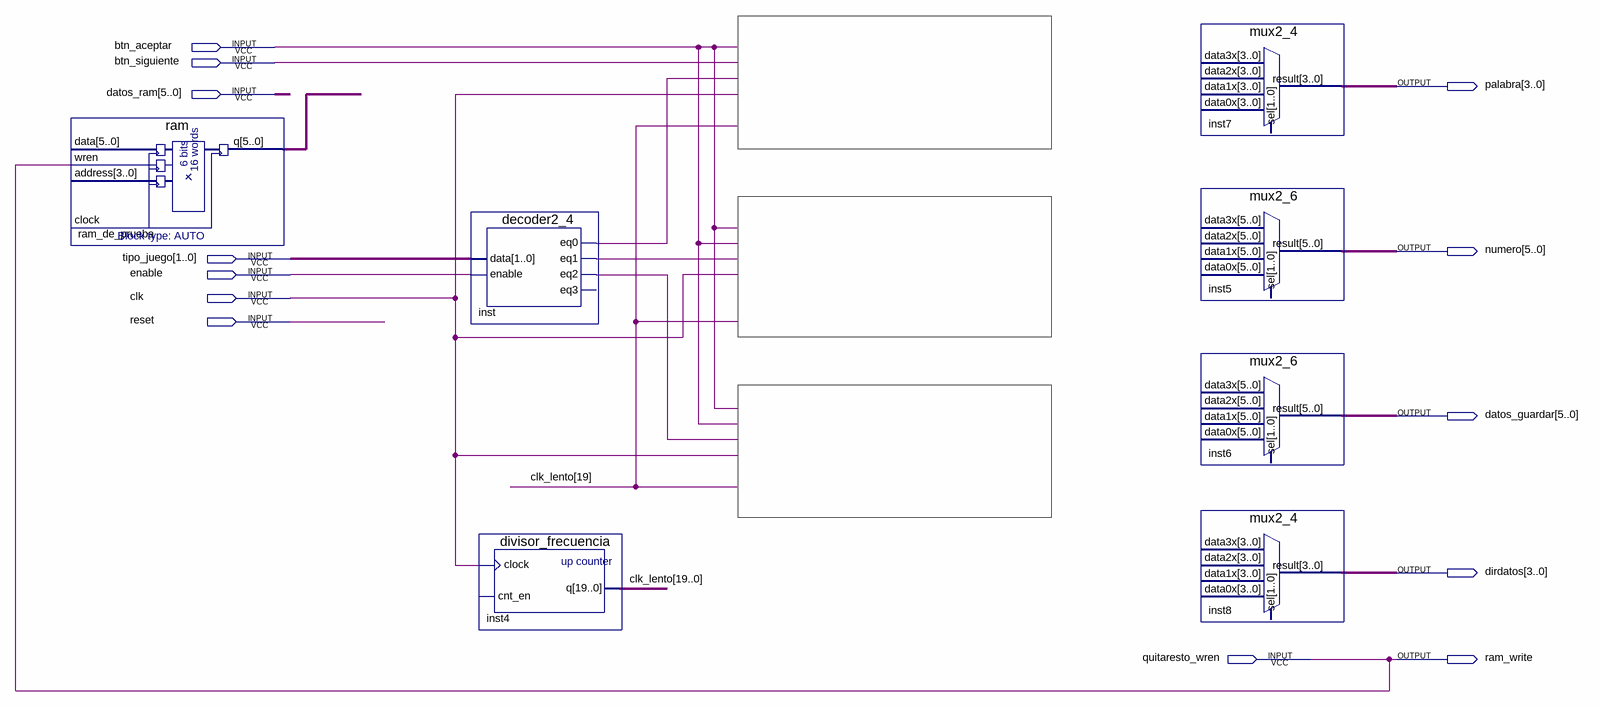
[diagram p0: schematic sheet]
// Quartus schematic bloque_juego.bdf as structural Verilog: 7 symbols, 13 pins
module bloque_juego (
  input  btn_aceptar,
  input  btn_siguiente,
  input  [5:0] datos_ram,
  input  [1:0] tipo_juego,
  input  enable,
  input  clk,
  input  reset,
  input  quitaresto_wren,
  output [3:0] palabra,
  output [5:0] numero,
  output [5:0] datos_guardar,
  output [3:0] dirdatos,
  output ram_write
);

  wire inst_eq0, inst_eq1, inst_eq2;
  wire [5:0] ram_de_prueba_q;
  wire [19:0] clk_lento;

  ram ram_de_prueba (.wren(quitaresto_wren), .q(ram_de_prueba_q));  // open: data, address, clock
  decoder2_4 inst (.data(tipo_juego), .enable(enable), .eq0(inst_eq0), .eq1(inst_eq1), .eq2(inst_eq2));  // open: eq3
  divisor_frecuencia inst4 (.clock(clk), .q(clk_lento));  // open: cnt_en
  mux2_4 inst7 (.result(palabra));  // open: data3x, data2x, data1x, data0x, sel
  mux2_6 inst5 (.result(numero));  // open: data3x, data2x, data1x, data0x, sel
  mux2_6 inst6 (.result(datos_guardar));  // open: data3x, data2x, data1x, data0x, sel
  mux2_4 inst8 (.result(dirdatos));  // open: data3x, data2x, data1x, data0x, sel

  assign ram_write = quitaresto_wren;
endmodule
